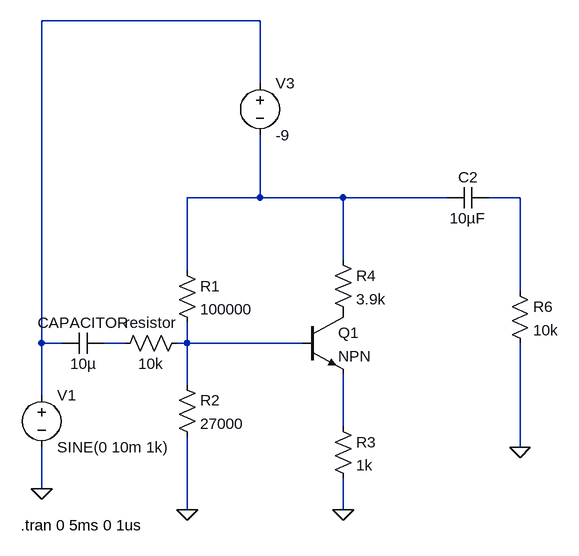
[diagram p0: schematic circuit diagram.asc]
circuit diagram.asc, the LTspice schematic file:
Version 4.1
SHEET 1 880 680
WIRE 368 -448 32 -448
WIRE 368 -352 368 -448
WIRE 368 -176 368 -272
WIRE 368 -176 256 -176
WIRE 496 -176 368 -176
WIRE 656 -176 496 -176
WIRE 768 -176 720 -176
WIRE 496 -80 496 -176
WIRE 256 -64 256 -176
WIRE 768 -32 768 -176
WIRE 32 48 32 -448
WIRE 64 48 32 48
WIRE 160 48 128 48
WIRE 256 48 256 16
WIRE 256 48 240 48
WIRE 432 48 256 48
WIRE 256 112 256 48
WIRE 32 128 32 48
WIRE 496 176 496 96
WIRE 768 208 768 48
WIRE 32 272 32 208
WIRE 256 304 256 192
WIRE 496 304 496 256
FLAG 256 304 0
FLAG 496 304 0
FLAG 768 208 0
FLAG 32 272 0
SYMBOL voltage 32 112 R0
WINDOW 123 0 0 Left 0
WINDOW 39 0 0 Left 0
SYMATTR InstName V1
SYMATTR Value SINE(0 10m 1k)
SYMBOL res 240 -80 R0
SYMATTR InstName R1
SYMATTR Value 100000
SYMBOL res 240 96 R0
SYMATTR InstName R2
SYMATTR Value 27000
SYMBOL npn 432 0 R0
SYMATTR InstName Q1
SYMBOL res 480 160 R0
SYMATTR InstName R3
SYMATTR Value 1k
SYMBOL res 480 -96 R0
SYMATTR InstName R4
SYMATTR Value 3.9k
SYMBOL cap 720 -192 R90
WINDOW 0 0 32 VBottom 2
WINDOW 3 32 32 VTop 2
SYMATTR InstName C2
SYMATTR Value 10µF
SYMBOL res 752 -48 R0
SYMATTR InstName R6
SYMATTR Value 10k
SYMBOL voltage 368 -368 R0
WINDOW 123 0 0 Left 0
WINDOW 39 0 0 Left 0
SYMATTR InstName V3
SYMATTR Value -9
SYMBOL res 256 32 R90
WINDOW 0 0 56 VBottom 2
WINDOW 3 32 56 VTop 2
SYMATTR InstName resistor
SYMATTR Value 10k
SYMBOL cap 128 32 R90
WINDOW 0 0 32 VBottom 2
WINDOW 3 32 32 VTop 2
SYMATTR InstName CAPACITOR
SYMATTR Value 10µ
TEXT 0 328 Left 2 !.tran 0 5ms 0 1us

The netlist it stands for:
* circuit diagram.asc
V1 N001 0 SINE(0 10m 1k)
R1 N002 N005 100000
R2 N005 0 27000
Q1 P001 N005 N006 0 NPN
R3 N006 0 1k
R4 N002 P001 3.9k
C2 N003 N002 10µF
R6 N003 0 10k
V3 N001 N002 -9
resistor N005 N004 10k
CAPACITOR N004 N001 10µ
.model NPN NPN
.model PNP PNP
.lib standard.bjt
.tran 0 5ms 0 1us
.backanno
.end